# Altium schematic sheet MAIN.SchDoc
size A4
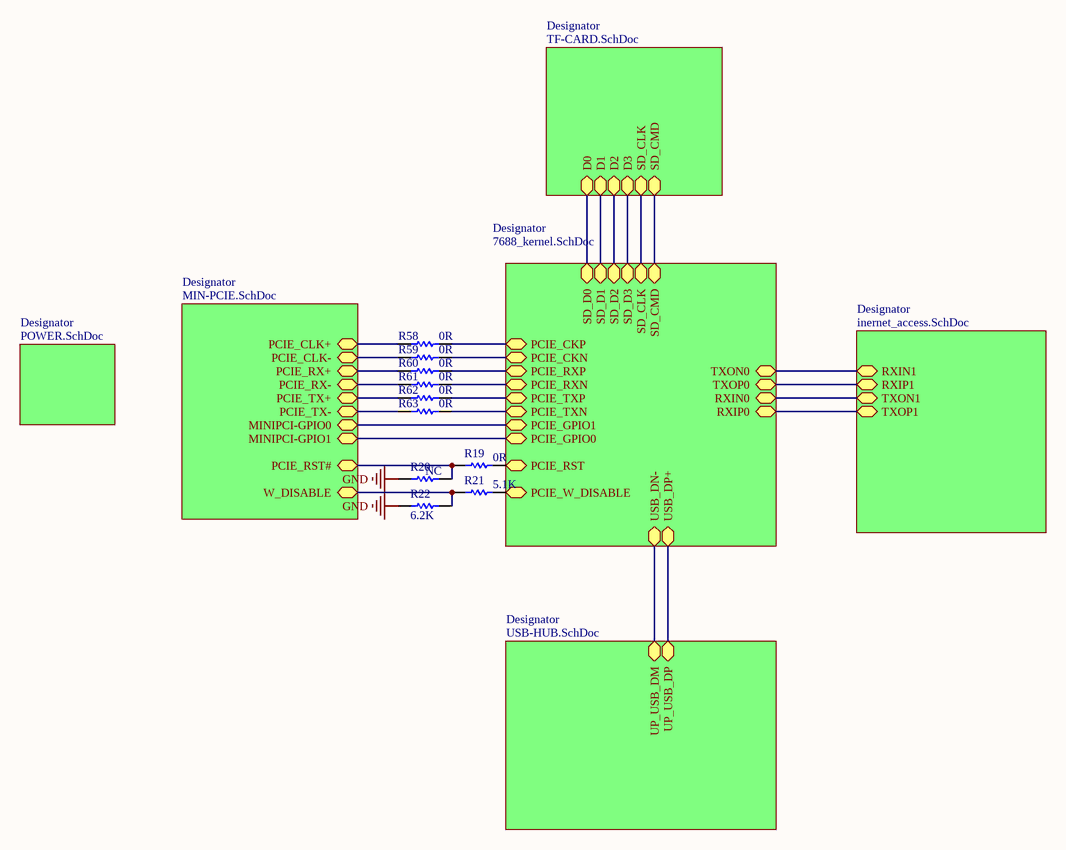
[diagram p0: MAIN.SchDoc]

## Parts
R19  value 0R  [R0603N]
R20  value NC  [R0603N]
R21  value 5.1K  [R0603N]
R22  value 6.2K  [R0603N]
R58  value 0R  [R0603N]
R59  value 0R  [R0603N]
R60  value 0R  [R0603N]
R61  value 0R  [R0603N]
R62  value 0R  [R0603N]
R63  value 0R  [R0603N]

## Sub-sheets
Designator = POWER.SchDoc: no entries
Designator = 7688_kernel.SchDoc: TXON0, TXOP0, RXIN0, RXIP0, USB_DP+, USB_DN-, SD_D0, SD_D1, SD_D2, SD_D3, SD_CLK, SD_CMD, PCIE_CKP, PCIE_CKN, PCIE_RXP, PCIE_RXN, PCIE_TXP, PCIE_TXN, PCIE_GPIO1, PCIE_GPIO0, PCIE_RST, PCIE_W_DISABLE
Designator = inernet_access.SchDoc: RXIN1, RXIP1, TXOP1, TXON1
Designator = USB-HUB.SchDoc: UP_USB_DP, UP_USB_DM
Designator = TF-CARD.SchDoc: D0, D1, D2, D3, SD_CMD, SD_CLK
Designator = MIN-PCIE.SchDoc: PCIE_CLK+, PCIE_CLK-, PCIE_TX+, PCIE_TX-, PCIE_RX+, PCIE_RX-, MINIPCI-GPIO1, MINIPCI-GPIO0, PCIE_RST#, W_DISABLE

## Nets
GND: R20.2 R22.2
NetR19_1: R19.1 R20.1 ; sheet Designator/PCIE_RST#
NetR19_2: R19.2 ; sheet Designator/PCIE_RST
NetR21_1: R21.1 R22.1 ; sheet Designator/W_DISABLE
NetR21_2: R21.2 ; sheet Designator/PCIE_W_DISABLE
NetR58_1: R58.1 ; sheet Designator/PCIE_CKP
NetR58_2: R58.2 ; sheet Designator/PCIE_CLK+
NetR59_1: R59.1 ; sheet Designator/PCIE_CKN
NetR59_2: R59.2 ; sheet Designator/PCIE_CLK-
NetR60_1: R60.1 ; sheet Designator/PCIE_RXP
NetR60_2: R60.2 ; sheet Designator/PCIE_RX+
NetR61_1: R61.1 ; sheet Designator/PCIE_RXN
NetR61_2: R61.2 ; sheet Designator/PCIE_RX-
NetR62_1: R62.1 ; sheet Designator/PCIE_TXP
NetR62_2: R62.2 ; sheet Designator/PCIE_TX+
NetR63_1: R63.1 ; sheet Designator/PCIE_TXN
NetR63_2: R63.2 ; sheet Designator/PCIE_TX-
(unnamed): sheet Designator/TXON0, sheet Designator/RXIN1
(unnamed): sheet Designator/TXOP0, sheet Designator/RXIP1
(unnamed): sheet Designator/RXIN0, sheet Designator/TXON1
(unnamed): sheet Designator/RXIP0, sheet Designator/TXOP1
(unnamed): sheet Designator/USB_DP+, sheet Designator/UP_USB_DP
(unnamed): sheet Designator/USB_DN-, sheet Designator/UP_USB_DM
(unnamed): sheet Designator/SD_D0, sheet Designator/D0
(unnamed): sheet Designator/SD_D1, sheet Designator/D1
(unnamed): sheet Designator/SD_D2, sheet Designator/D2
(unnamed): sheet Designator/SD_D3, sheet Designator/D3
(unnamed): sheet Designator/SD_CLK, sheet Designator/SD_CLK
(unnamed): sheet Designator/SD_CMD, sheet Designator/SD_CMD
(unnamed): sheet Designator/PCIE_GPIO1, sheet Designator/MINIPCI-GPIO0
(unnamed): sheet Designator/PCIE_GPIO0, sheet Designator/MINIPCI-GPIO1

## Library data of the parts
R19-R22 R58-R63 = Res Semi: Semiconductor Resistor; Published: 8-Jun-2000; LatestRevisionDate: 17-Jul-2002; LatestRevisionNote: Re-released for DXP Platform.; PackageReference: AXIAL-0.5; Publisher: Altium Limited